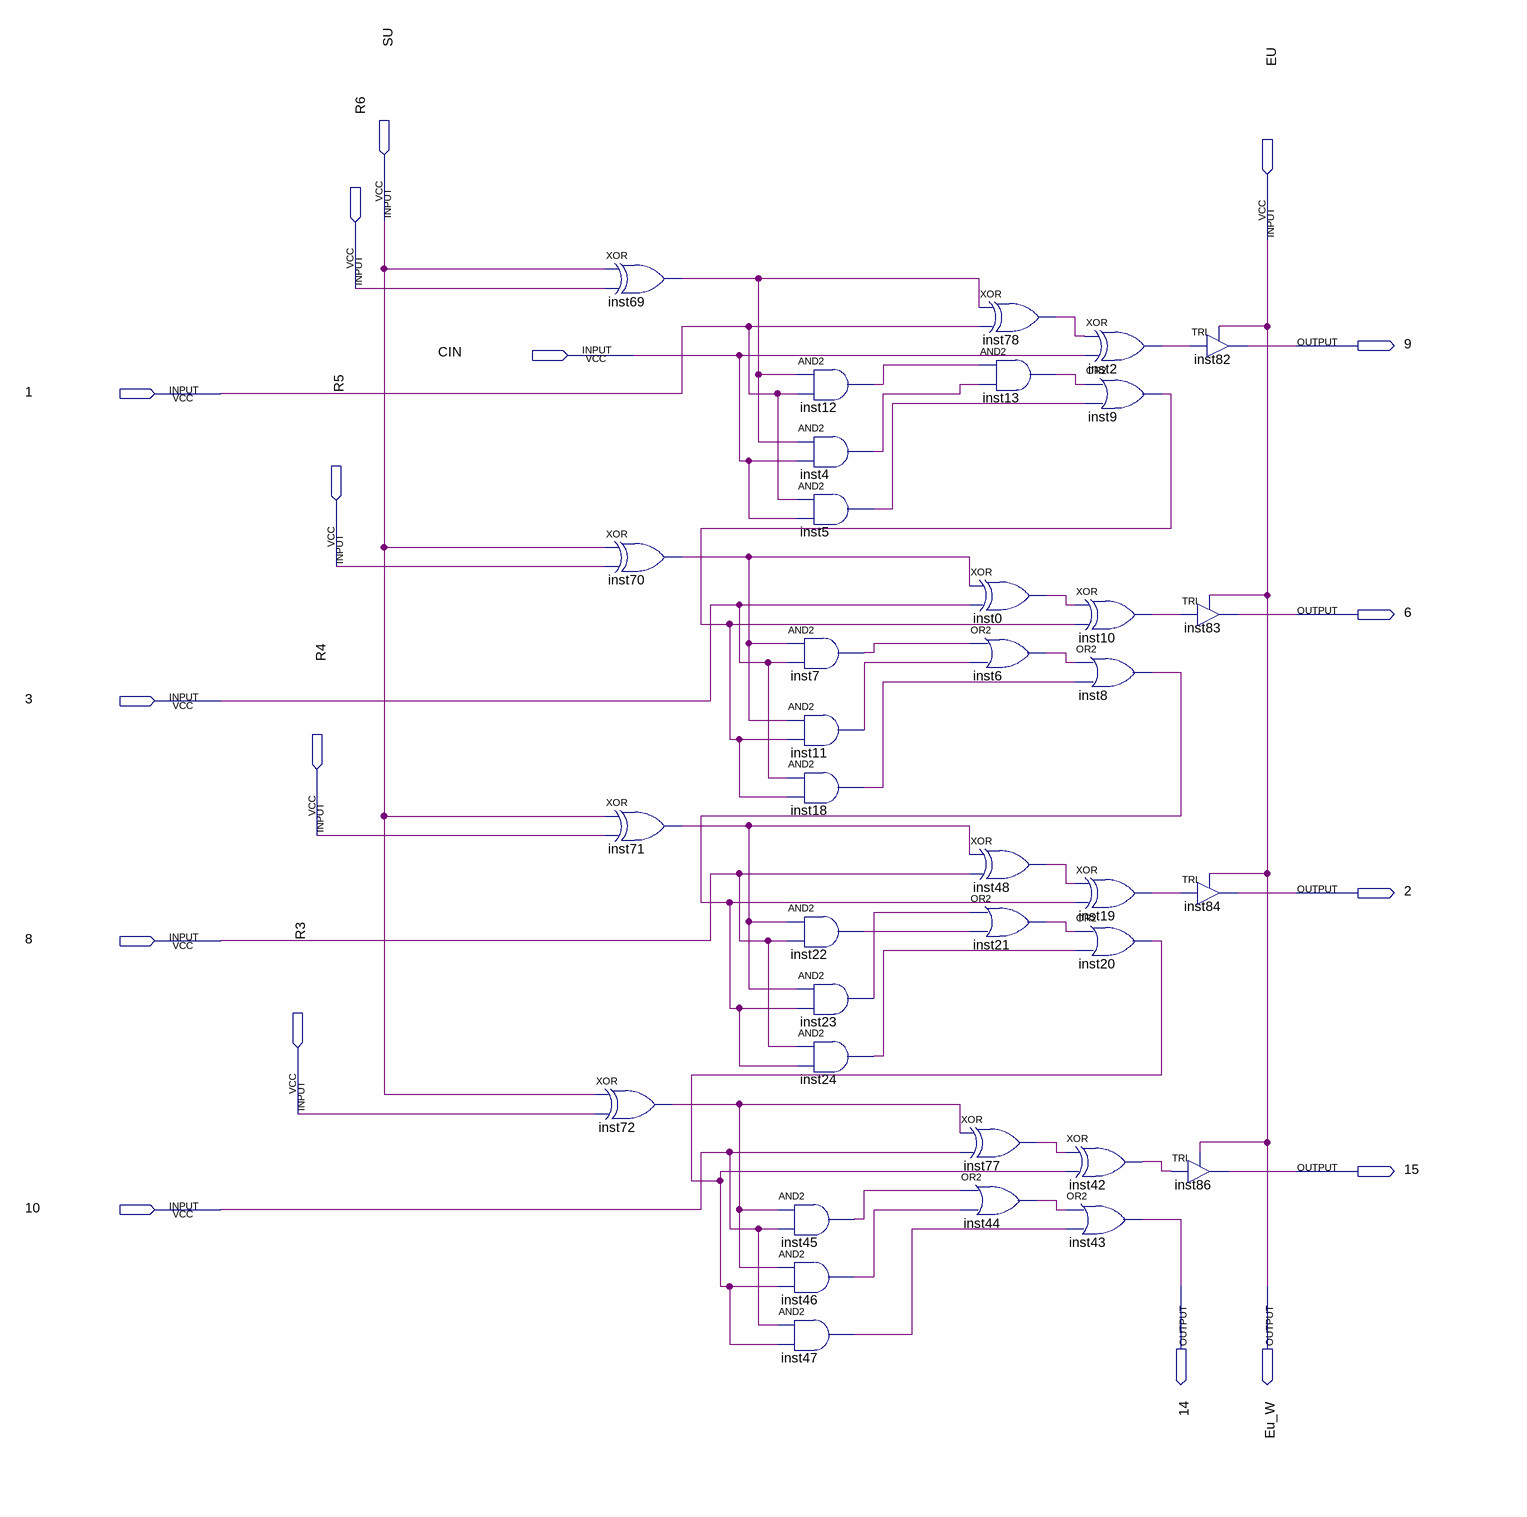
[diagram p0: schematic sheet]
// Quartus schematic Somador_Subtrator.bdf as structural Verilog: 36 symbols, 17 pins
module Somador_Subtrator (
  input  SU,
  input  EU,
  input  R6,
  input  CIN,
  input  \1 ,
  input  R5,
  input  \3 ,
  input  R4,
  input  \8 ,
  input  R3,
  input  \10 ,
  output \9 ,
  output \6 ,
  output \2 ,
  output \15 ,
  output \14 ,
  output Eu_W
);

  wire inst0_out, inst2_out, inst4_out, inst5_out, inst6_out, inst7_out, inst8_out, inst9_out, inst10_out,
       inst11_out, inst12_out, inst13_out, inst18_out, inst19_out, inst20_out, inst21_out, inst22_out,
       inst23_out, inst24_out, inst42_out, inst44_out, inst45_out, inst46_out, inst47_out, inst48_out,
       inst69_out, inst70_out, inst71_out, inst72_out, inst77_out, inst78_out;

  xor inst69 (inst69_out, SU, R6);
  xor inst70 (inst70_out, SU, R5);
  xor inst71 (inst71_out, SU, R4);
  xor inst72 (inst72_out, SU, R3);
  and inst12 (inst12_out, inst69_out, \1 );
  and inst4 (inst4_out, inst69_out, CIN);
  and inst5 (inst5_out, \1 , CIN);
  and inst7 (inst7_out, inst70_out, \3 );
  and inst11 (inst11_out, inst70_out, inst9_out);
  and inst18 (inst18_out, \3 , inst9_out);
  and inst22 (inst22_out, inst71_out, \8 );
  and inst23 (inst23_out, inst71_out, inst8_out);
  and inst24 (inst24_out, \8 , inst8_out);
  and inst45 (inst45_out, inst72_out, \10 );
  and inst46 (inst46_out, inst72_out, inst20_out);
  and inst47 (inst47_out, \10 , inst20_out);
  xor inst0 (inst0_out, inst70_out, \3 );
  or inst6 (inst6_out, inst7_out, inst11_out);
  xor inst48 (inst48_out, inst71_out, \8 );
  or inst21 (inst21_out, inst23_out, inst22_out);
  xor inst77 (inst77_out, inst72_out, \10 );
  or inst44 (inst44_out, inst45_out, inst46_out);
  xor inst78 (inst78_out, inst69_out, \1 );
  and inst13 (inst13_out, inst12_out, inst4_out);
  xor inst2 (inst2_out, inst78_out, CIN);
  or inst9 (inst9_out, inst13_out, inst5_out);
  xor inst10 (inst10_out, inst0_out, inst9_out);
  or inst8 (inst8_out, inst6_out, inst18_out);
  xor inst19 (inst19_out, inst48_out, inst8_out);
  or inst20 (inst20_out, inst21_out, inst24_out);
  xor inst42 (inst42_out, inst77_out, inst20_out);
  or inst43 (\14 , inst44_out, inst47_out);
  TRI inst82 (.IN(inst2_out), .OE(EU), .OUT(\9 ));
  TRI inst83 (.IN(inst10_out), .OE(EU), .OUT(\6 ));
  TRI inst84 (.IN(inst19_out), .OE(EU), .OUT(\2 ));
  TRI inst86 (.IN(inst42_out), .OE(EU), .OUT(\15 ));

  assign Eu_W = EU;
endmodule
